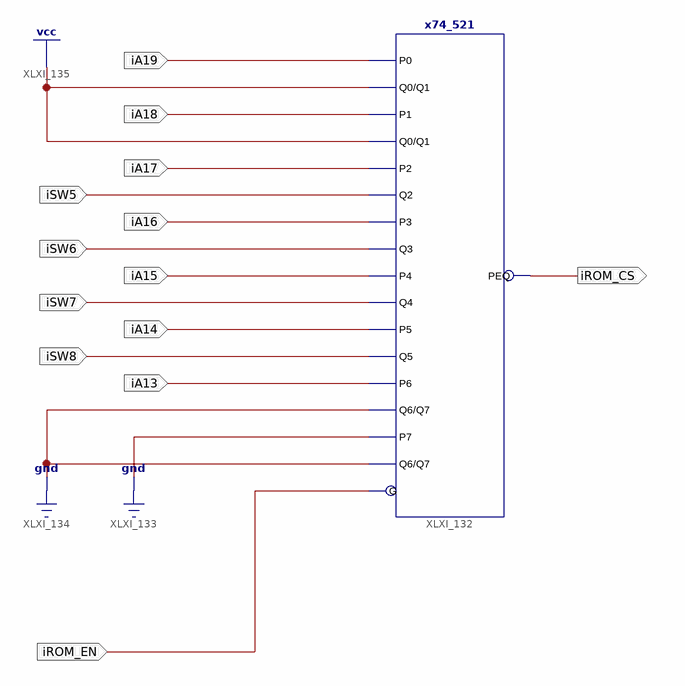
[diagram p0: schematic sheet 1]
// Xilinx ISE schematic ROM_DECODE.sch (xc9500xl) as structural Verilog: 1 symbols, 13 ports
module ROM_DECODE (
  input  iA19,
  input  iA18,
  input  iA17,
  input  iA16,
  input  iA15,
  input  iA14,
  input  iSW5,
  input  iSW6,
  input  iSW7,
  input  iA13,
  input  iSW8,
  input  iROM_EN,
  output iROM_CS
);

  x74_521 XLXI_132 (
    .G(iROM_EN), .P0(iA19), .P1(iA18), .P2(iA17), .P3(iA16), .P4(iA15), .P5(iA14), .P6(iA13), .P7(1'b0),
    .Q0(1'b1), .Q1(1'b1), .Q2(iSW5), .Q3(iSW6), .Q4(iSW7), .Q5(iSW8), .Q6(1'b0), .Q7(1'b0), .PEQ(iROM_CS));
endmodule
